# Altium schematic sheet Beambreak Array L - Receiver.SchDoc
size 297 x 209 mm; CompanyName: Sainsbury Wellcome Centre; Organization: Innovation and Research FabLab; Address1: Sainsbury Wellcome Centre; Address2: 25 Howland Street; Address3: London; Address4: W1T 4JG; DocumentNumber: PIEUddmmyy; SheetNumber: 1; SheetTotal: 1; swcgroup: Innovation and Research; Org: Sainsbury Wellcome Centre; Add1: 25 Howland Street; Add2: London; Add3: W1T 4JG; WebAddress: www.sainsburywellcome.org; SheetSize: A4
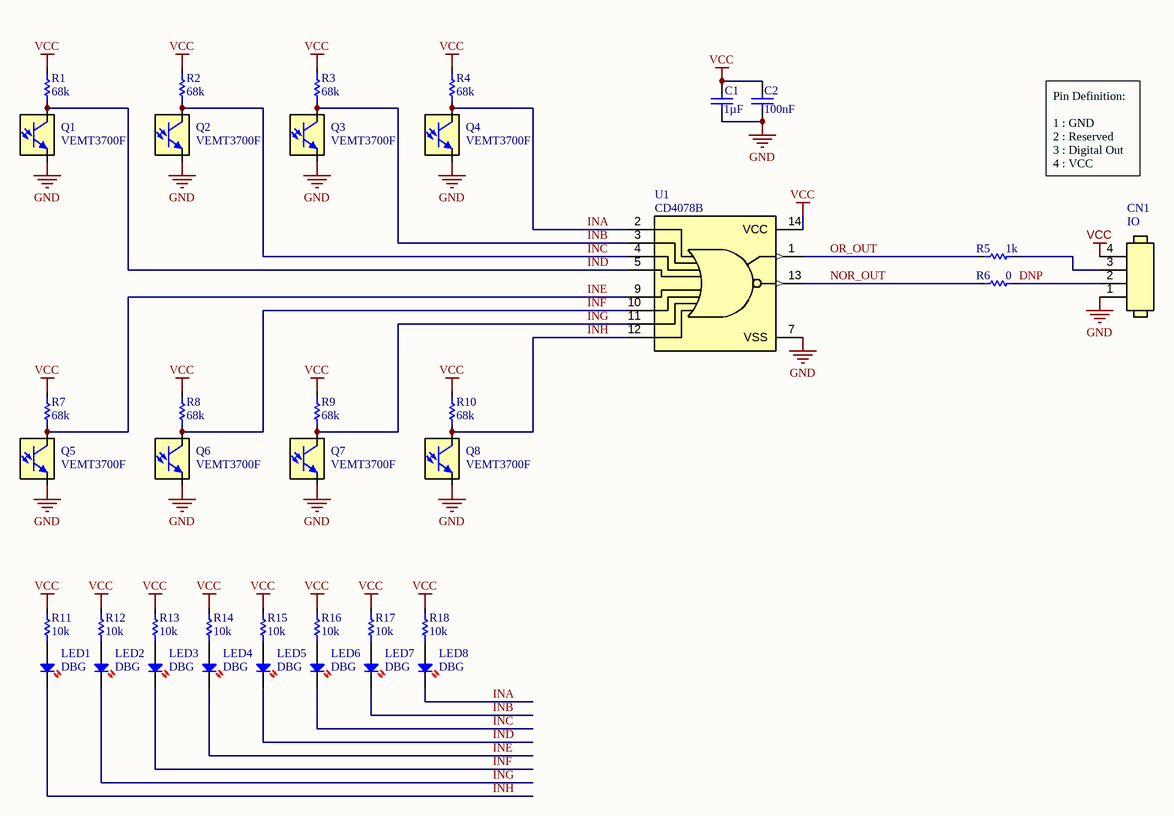
[diagram p0: Beambreak Array L - Receiver.SchDoc]

## Parts
C1  value 1µF  [CAP_CHIP_0603]  (hidden comment: C0603-1uF-50V)
C2  value 100nF  [CAP_CHIP_0603]  (hidden comment: C0603-100nF-50V)
CN1  IO  [MOLEX_1.25_4P]
LED1  DBG  [LED_CHIP_0805]
LED2  DBG  [LED_CHIP_0805]
LED3  DBG  [LED_CHIP_0805]
LED4  DBG  [LED_CHIP_0805]
LED5  DBG  [LED_CHIP_0805]
LED6  DBG  [LED_CHIP_0805]
LED7  DBG  [LED_CHIP_0805]
LED8  DBG  [LED_CHIP_0805]
Q1  VEMT3700F  [PT_3528_NPN]
Q2  VEMT3700F  [PT_3528_NPN]
Q3  VEMT3700F  [PT_3528_NPN]
Q4  VEMT3700F  [PT_3528_NPN]
Q5  VEMT3700F  [PT_3528_NPN]
Q6  VEMT3700F  [PT_3528_NPN]
Q7  VEMT3700F  [PT_3528_NPN]
Q8  VEMT3700F  [PT_3528_NPN]
R1  value 68k  [RES_CHIP_0603]  (hidden comment: R0603-68K)
R2  value 68k  [RES_CHIP_0603]  (hidden comment: R0603-68K)
R3  value 68k  [RES_CHIP_0603]  (hidden comment: R0603-68K)
R4  value 68k  [RES_CHIP_0603]  (hidden comment: R0603-68K)
R5  value 1k  [RES_CHIP_0603]  (hidden comment: R0603-1K)
R6  value 0  LCSC Part N.: DNP  [RES_CHIP_0603]  (hidden comment: R0603-0R)
R7  value 68k  [RES_CHIP_0603]  (hidden comment: R0603-68K)
R8  value 68k  [RES_CHIP_0603]  (hidden comment: R0603-68K)
R9  value 68k  [RES_CHIP_0603]  (hidden comment: R0603-68K)
R10  value 68k  [RES_CHIP_0603]  (hidden comment: R0603-68K)
R11  value 10k  [RES_CHIP_0603]  (hidden comment: R0603-10K)
R12  value 10k  [RES_CHIP_0603]  (hidden comment: R0603-10K)
R13  value 10k  [RES_CHIP_0603]  (hidden comment: R0603-10K)
R14  value 10k  [RES_CHIP_0603]  (hidden comment: R0603-10K)
R15  value 10k  [RES_CHIP_0603]  (hidden comment: R0603-10K)
R16  value 10k  [RES_CHIP_0603]  (hidden comment: R0603-10K)
R17  value 10k  [RES_CHIP_0603]  (hidden comment: R0603-10K)
R18  value 10k  [RES_CHIP_0603]  (hidden comment: R0603-10K)
U1  CD4078B  [SOIC14]

## Nets
GND: C1.2 C2.1 CN1.1 Q1.2(E) Q2.2(E) Q3.2(E) Q4.2(E) Q5.2(E) Q6.2(E) Q7.2(E) Q8.2(E) U1.7(VSS)
VCC: C1.1 C2.2 CN1.4 R1.2 R2.2 R3.2 R4.2 R7.2 R8.2 R9.2 R10.2 R11.2 R12.2 R13.2 R14.2 R15.2 R16.2 R17.2 R18.2 U1.14(VCC)
INA: LED8.1(K) Q4.1(C) R4.1 U1.2(1A)
INB: LED7.1(K) Q3.1(C) R3.1 U1.3(1A)
INC: LED6.1(K) Q2.1(C) R2.1 U1.4(1A)
IND: LED5.1(K) Q1.1(C) R1.1 U1.5(1A)
INE: LED4.1(K) Q5.1(C) R7.1 U1.9(1B)
INF: LED3.1(K) Q6.1(C) R8.1 U1.10(2A)
ING: LED2.1(K) Q7.1(C) R9.1 U1.11(2B)
INH: LED1.1(K) Q8.1(C) R10.1 U1.12(1A)
NOR_OUT: R6.1 U1.13(OUT)
OR_OUT: R5.2 U1.1(~{OUT})
NetCN1_2: CN1.2 R6.2
NetCN1_3: CN1.3 R5.1
NetLED1_2: LED1.2(A) R11.1
NetLED2_2: LED2.2(A) R12.1
NetLED3_2: LED3.2(A) R13.1
NetLED4_2: LED4.2(A) R14.1
NetLED5_2: LED5.2(A) R15.1
NetLED6_2: LED6.2(A) R16.1
NetLED7_2: LED7.2(A) R17.1
NetLED8_2: LED8.2(A) R18.1

## Notes on the sheet
- Pin Definition:
  1 : GND
  2 : Reserved
  3 : Digital Out
  4 : VCC
- FILE
- VARIANT
- DATE
- REVISION
- SHEET
- /
- PROJECT
- SIZE

## Library data of the parts
C1 = CMP-611-0033-11: 0603 Multilayer Ceramic Capacitors MLCC; PartNumber: CL10A105KB8NNNC; Pick&PlaceFootprint: C0603; Voltage Rating: 50V; Dielectric: X5R; Tolerance: 10%; Case/Package: 0603; LCSC Part N.: C15849; RoHS: Yes; Mount: SMD; Capacitor Type: Ceramic
C2 = CMP-611-0027-24: 0603 Multilayer Ceramic Capacitors MLCC; PartNumber: CC0603KRX7R9BB104; Tolerance: 10%; Pick&PlaceFootprint: C0603; Dielectric: X7R; Voltage Rating: 50V; Capacitor Type: Ceramic; RoHS: Yes; Mount: SMD; LCSC Part N.: C14663; Case/Package: 0603
CN1 = CMP-370-0030-7: Conn Shrouded Header (3 Sides) HDR 4 POS 1.25mm Solder ST Top Entry SMD PicoBlade™ T/R; PartNumber: 53398-0471; Current Rating: 1A; Number of Positions: 4; Gender: Male; LCSC Part N.: C17617036; Orientation: Vertical; Number of Rows: 1; Pitch: 1.25mm; Mounting Technology: Surface Mount
LED1-LED8 = CMP-520-0019-2: Red 0805 Light Emitting Diodes (LED) ROHS; PartNumber: NCD0805R1; Wavelength: 620nm; Forward Current: 25mA; Pick&PlaceFootprint: LED0805; Forward Voltage: 2.1V; LCSC Part N.: C84256; Colour: Red; Mount: Surface Mount
Q1-Q8 = CMP-540-0001-1: No Phototransistor IR Chip Silicon 940nm 2-Pin PLCC T/R; PartNumber: VEMT3700F-GS08; Dark Current: 200nA; Max Collector Current: 50mA; Polarity: NPN; Rise Time: 6000ns; LCSC Part N.: C5334342; Wavelength: 940nm; Orientation: Top View
R1-R4 R7-R10 = CMP-633-0107-3: 100mW Thick Film Resistors 75V ±100ppm/℃ ±1% 0603 Chip Resistor; PartNumber: 0603WAF6802T5E; Pick&PlaceFootprint: R0603; Number of Resistors: 1; Tolerance: 1%; LCSC Part N.: C23231; Case/Package: 0603; Power Rating: 100mW; Mount: Surface Mount; Voltage Rating: 75V
R5 = CMP-633-0013-26: 100mW Thick Film Resistors 75V ±100ppm/℃ ±1% 0603 Chip Resistor; PartNumber: 0603WAF1001T5E; Pick&PlaceFootprint: R0603; Number of Resistors: 1; Voltage Rating: 75V; Case/Package: 0603; Tolerance: 1%; Mount: Surface Mount; LCSC Part N.: C21190; Power Rating: 100mW
R6 = CMP-633-0049-25: 100mW Thick Film Resistors 75V ±100ppm/℃ ±1% 0603 Chip Resistor; PartNumber: 0603WAF0000T5E; Number of Resistors: 1; Pick&PlaceFootprint: R0603; Voltage Rating: 75V; Tolerance: 1%; Mount: Surface Mount; Case/Package: 0603; Power Rating: 100mW
R11-R18 = CMP-633-0002-26: 100mW Thick Film Resistors 75V ±100ppm/℃ ±1% 0603 Chip Resistor; PartNumber: 0603WAF1002T5E; Number of Resistors: 1; Pick&PlaceFootprint: R0603; Case/Package: 0603; Voltage Rating: 75V; Power Rating: 100mW; LCSC Part N.: C25804; Tolerance: 1%; Mount: Surface Mount
U1 = CMP-950-0028-2: IC GATE NOR/OR 8INPUT 14SOIC NOR/OR Gate Configurable 1 Circuit 8 Input 14-SOIC; PartNumber: CD4078BM96; Channels: 8; Number of Bits: 1; Propagation Delay: 110ns; Max Supply Voltage: 18V; Min Supply Voltage: 3V; Logic Function: NOR, OR; Number of Circuits: 1; LCSC Part N.: C84464; Pick&PlaceFootprint: SOIC14